# EasyEDA schematic neonred-live-2026-10-06.json
TITLE: NEONRED; REV: 1.0; Date: 2026-10-04; Sheet: 1/1; Drawn By: matthieu3241; Company: Your Company
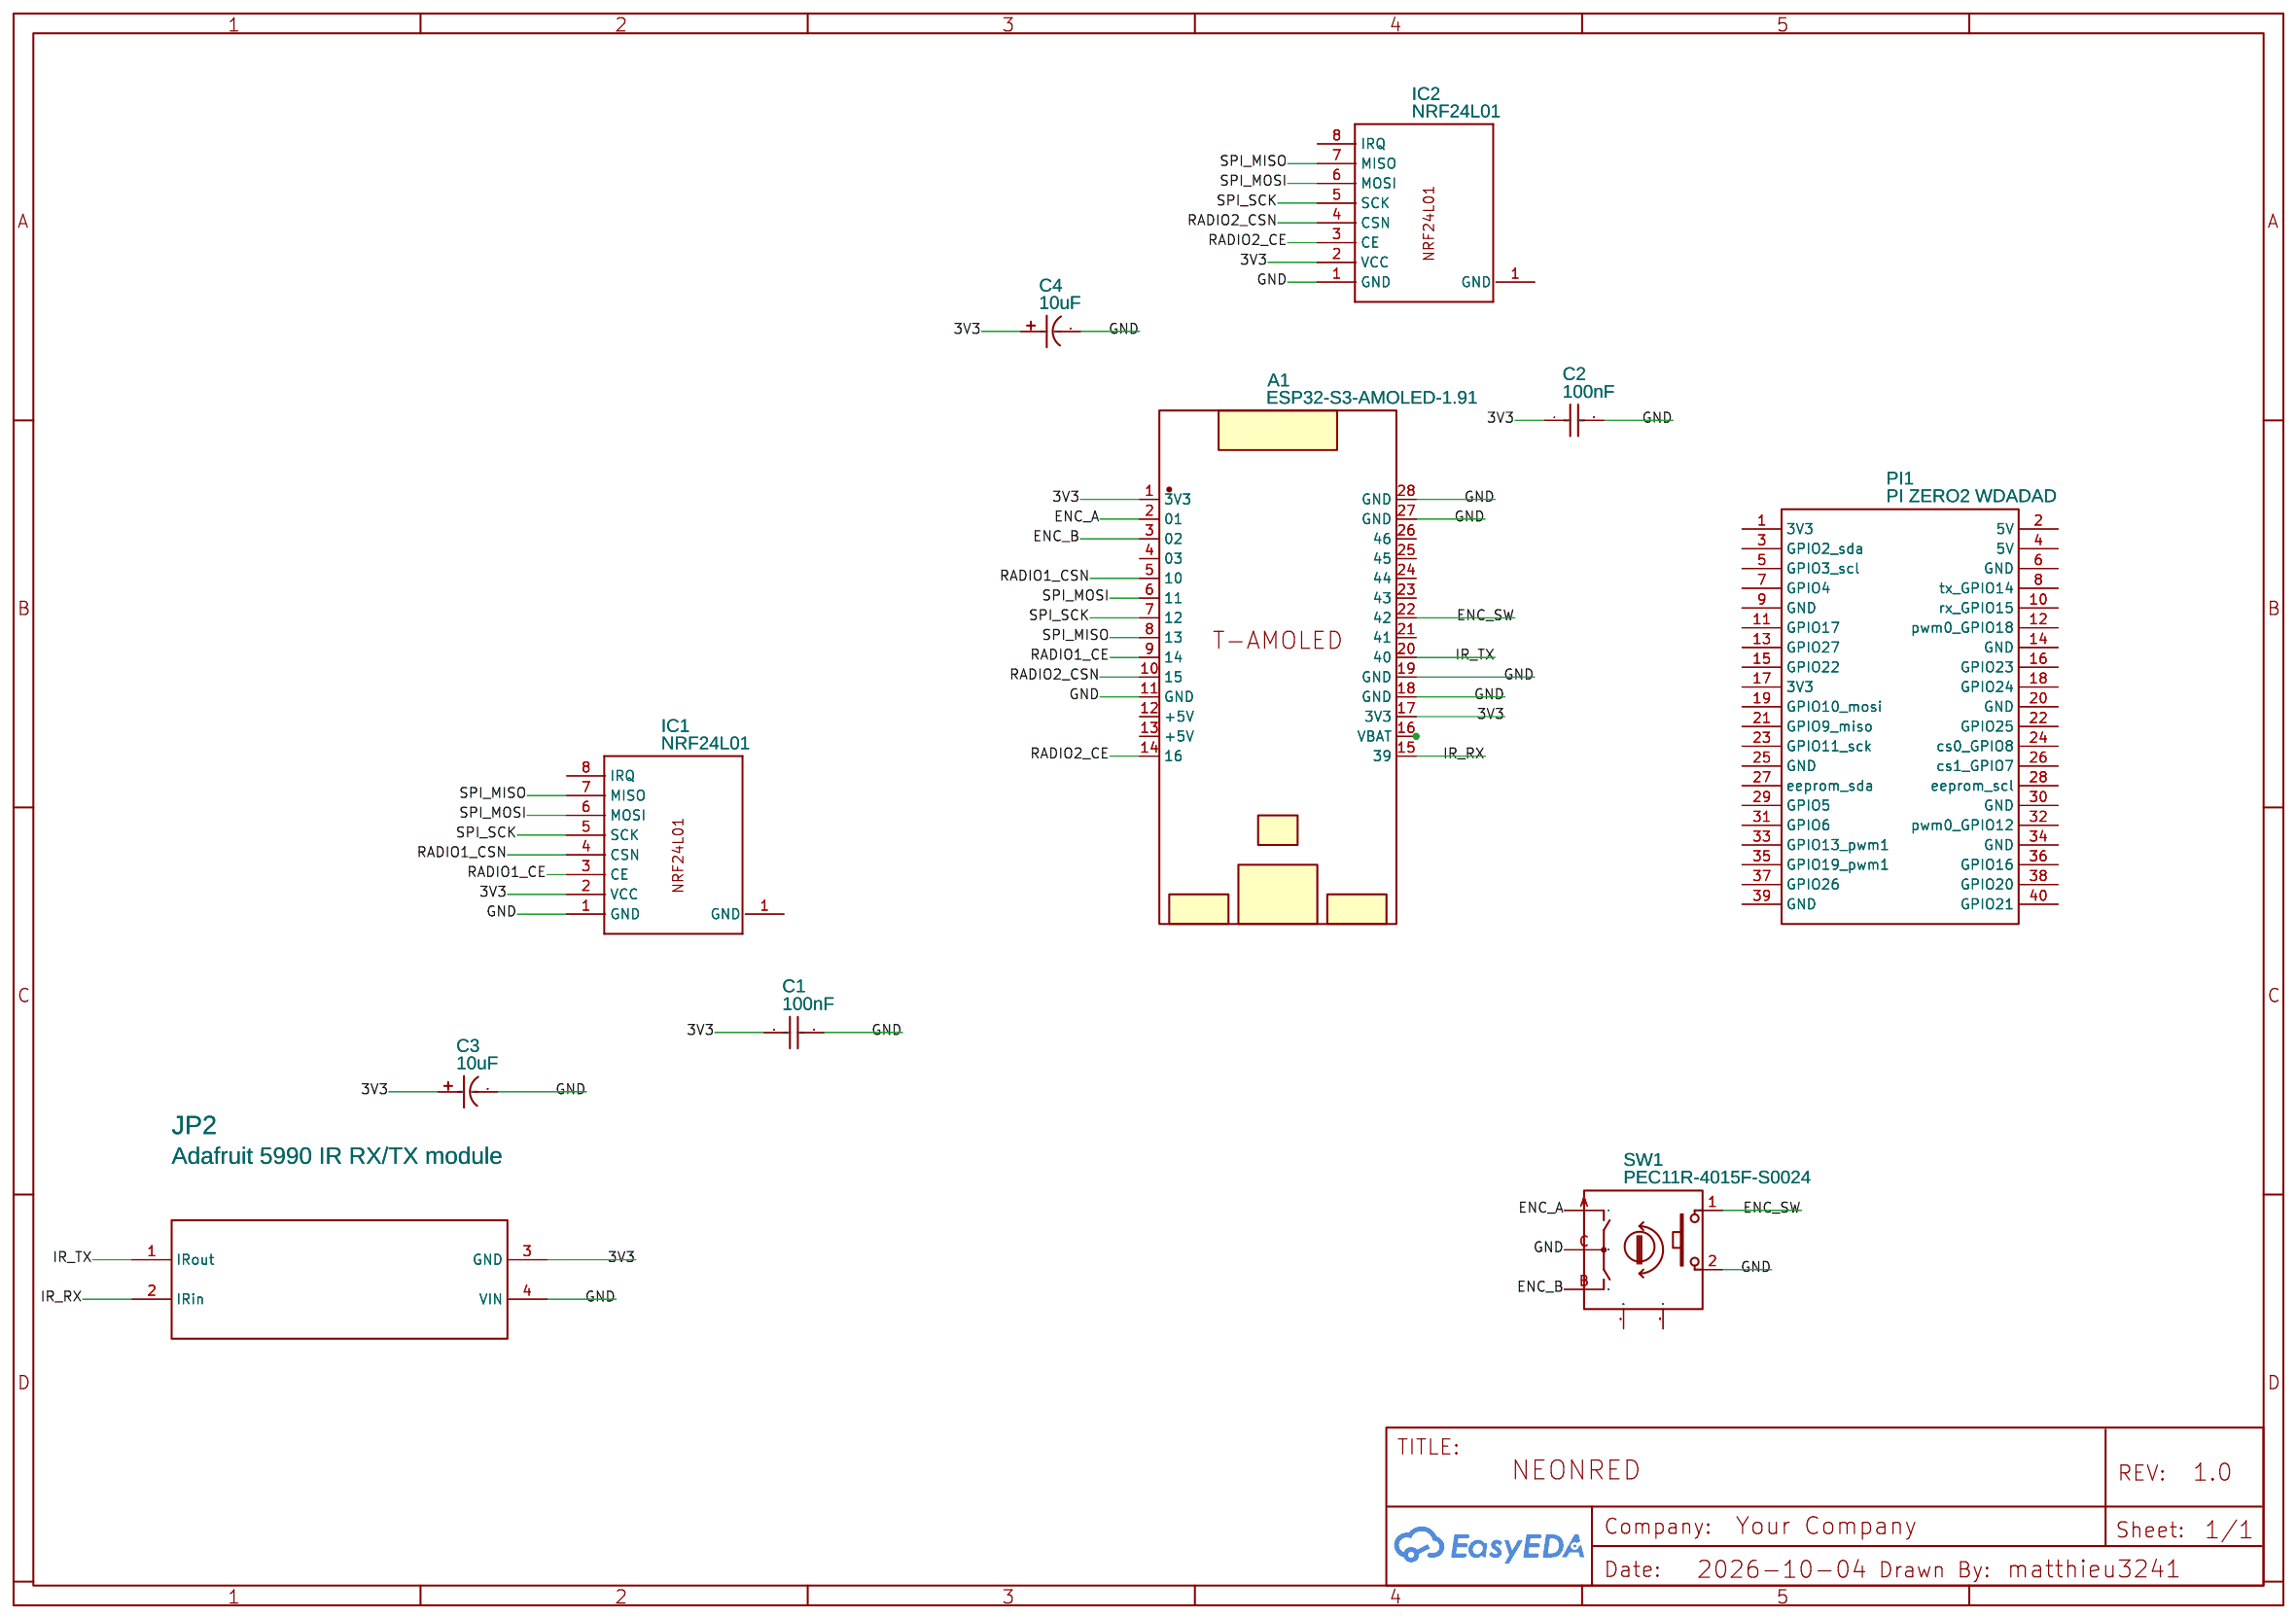
[diagram p0: schematic sheet]

## Parts
A1  ESP32-S3-AMOLED-1.91  [T-DISPLAY S3 AMOLED]
C1  100nF  [CAP-TH_L4.9-W3.7-P5.08-D0.5]
C2  100nF  [CAP-TH_L4.9-W3.7-P5.08-D0.5]
C3  10uF  [CAPACITOR 10UF TH FP]
C4  10uF  [CAPACITOR 10UF TH FP]
IC1  NRF24L01  [NRF24L01]
IC2  NRF24L01  [NRF24L01]
JP2  Adafruit 5990 IR RX/TX module  [HDR-1X4T/2.54/10X2_J9]
PI1  PI ZERO2 WDADAD  [RASPBERRY-PIZERO-W]
SW1  PEC11R-4015F-S0024  [SW-TH_PEC11R-4XXXF-SXXXX]

## Library data of the parts
A1 = ESP32-S3-AMOLED-1.91: Manufacturer: Lilygo; Manufacturer Part: T-Display S3 AMOLED; Supplier: Lilygo; link: https://www.lilygo.cc/products/t-display-s3-amoled; Contributor: adamzh
C1 C2 = 100nF: Supplier: LCSC; Manufacturer: null; Manufacturer Part: 0.1UF(104) +-20% 63v; Supplier Part: C19355; JLCPCB Part Class: Extended Part
C3 C4 = Capacitor 10uF TH: Contributor: airyrahman
IC1 IC2 = NRF24L01: Contributor: JoachimHugo1
JP2 = M04: Contributor: SparkFun
PI1 = PI ZERO2 WDADAD: Contributor: greg_dickson
SW1 = PEC11R-4015F-S0024: Contributor: LCSC; Supplier: LCSC; Supplier Part: C143789; Manufacturer: BOURNS; JLCPCB Part Class: Extended Part

## Nets
3V3: A1.1(3V3) A1.17(3V3) C1.1 C2.1 C3.1 C4.1 IC1.2(VCC) IC2.2(VCC) JP2.3(GND)
GND: A1.11(GND) A1.18(GND) A1.19(GND) A1.27(GND) A1.28(GND) C1.2 C2.2 C3.2 C4.2 IC1.1(GND) IC2.1(GND) JP2.4(VIN) SW1.2 SW1.C
ENC_A: A1.2(01) SW1.A
ENC_B: A1.3(02) SW1.B
ENC_SW: A1.22(42) SW1.1
IR_RX: A1.15(39) JP2.2(IRin)
IR_TX: A1.20(40) JP2.1(IRout)
RADIO1_CE: A1.9(14) IC1.3(CE)
RADIO1_CSN: A1.5(10) IC1.4(CSN)
RADIO2_CE: A1.14(16) IC2.3(CE)
RADIO2_CSN: A1.10(15) IC2.4(CSN)
SPI_MISO: A1.8(13) IC1.7(MISO) IC2.7(MISO)
SPI_MOSI: A1.6(11) IC1.6(MOSI) IC2.6(MOSI)
SPI_SCK: A1.7(12) IC1.5(SCK) IC2.5(SCK)

Not connected (* = marked no-connect by the designer): A1 4(03) 12(+5V) 13(+5V) 16(VBAT) 21(41) 23(43) 24(44) 25(45) 26(46); IC1 8(IRQ); IC2 8(IRQ); PI1 1(3V3) 2(5V) 3(GPIO2 sda) 4(5V) 5(GPIO3 scl) 6(GND) 7(GPIO4) 8(tx GPIO14) 9(GND) 10(rx GPIO15) 11(GPIO17) 12(pwm0 GPIO18) 13(GPIO27) 14(GND) 15(GPIO22) 16(GPIO23) 17(3V3) 18(GPIO24) 19(GPIO10 mosi) 20(GND) 21(GPIO9 miso) 22(GPIO25) 23(GPIO11 sck) 24(cs0 GPIO8) 25(GND) 26(cs1 GPIO7) 27(eeprom sda) 28(eeprom scl) 29(GPIO5) 30(GND) 31(GPIO6) 32(pwm0 GPIO12) 33(GPIO13 pwm1) 34(GND) 35(GPIO19 pwm1) 36(GPIO16) 37(GPIO26) 38(GPIO20) 39(GND) 40(GPIO21); SW1 MT1 MT2
